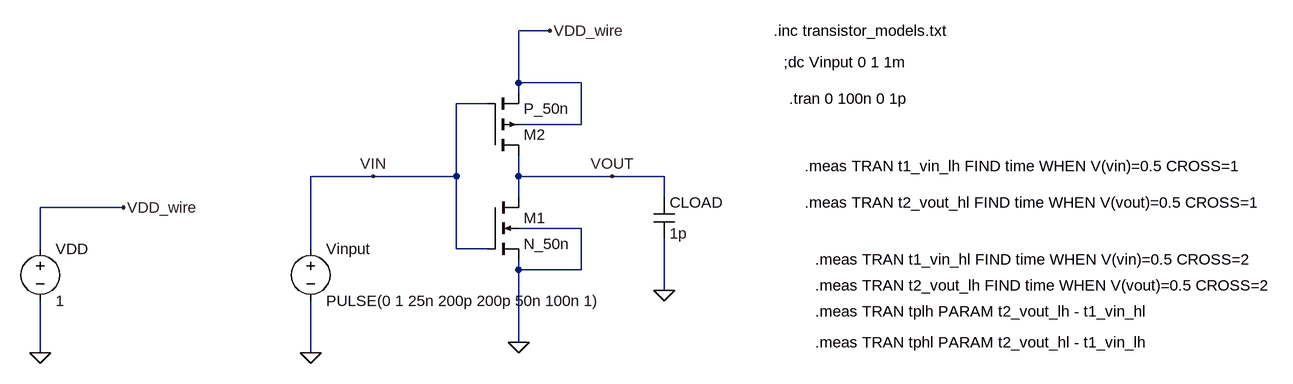
[diagram p0: schematic lab01_inverter_dc.asc]
lab01_inverter_dc.asc, the LTspice schematic file:
Version 4
SHEET 1 1652 680
WIRE 496 -80 448 -80
WIRE 448 0 448 -80
WIRE 544 0 448 0
WIRE 448 16 448 0
WIRE 400 32 352 32
WIRE 544 64 544 0
WIRE 544 64 448 64
WIRE 224 144 128 144
WIRE 352 144 352 32
WIRE 352 144 224 144
WIRE 448 144 448 112
WIRE 592 144 448 144
WIRE 672 144 592 144
WIRE 448 176 448 144
WIRE 672 176 672 144
WIRE -160 192 -288 192
WIRE 544 224 448 224
WIRE -288 256 -288 192
WIRE 128 256 128 144
WIRE 352 256 352 144
WIRE 400 256 352 256
WIRE 448 288 448 272
WIRE 544 288 544 224
WIRE 544 288 448 288
WIRE 672 320 672 240
WIRE 448 400 448 288
WIRE -288 416 -288 336
WIRE 128 416 128 336
FLAG 448 400 0
FLAG 128 416 0
FLAG -288 416 0
FLAG -160 192 VDD_wire
FLAG 496 -80 VDD_wire
FLAG 672 320 0
FLAG 592 144 VOUT
FLAG 224 144 VIN
SYMBOL voltage 128 240 R0
WINDOW 123 0 0 Left 0
WINDOW 39 0 0 Left 0
SYMATTR InstName Vinput
SYMATTR Value PULSE(0 1 25n 200p 200p 50n 100n 1)
SYMBOL voltage -288 240 R0
WINDOW 123 0 0 Left 0
WINDOW 39 0 0 Left 0
SYMATTR InstName VDD
SYMATTR Value 1
SYMBOL nmos4 400 176 R0
SYMATTR InstName M1
SYMATTR Value N_50n
SYMATTR Value2 l=50n w=500n
SYMBOL pmos4 400 112 M180
SYMATTR InstName M2
SYMATTR Value P_50n
SYMATTR Value2 l=50n w=1000n
SYMBOL cap 656 176 R0
SYMATTR InstName CLOAD
SYMATTR Value 1p
TEXT 840 -80 Left 2 !.inc transistor_models.txt
TEXT 856 -32 Left 2 !;dc Vinput 0 1 1m
TEXT 864 24 Left 2 !.tran 0 100n 0 1p
TEXT 888 128 Left 2 !.meas TRAN t1_vin_lh FIND time WHEN V(vin)=0.5 CROSS=1
TEXT 888 184 Left 2 !.meas TRAN t2_vout_hl FIND time WHEN V(vout)=0.5 CROSS=1
TEXT 904 400 Left 2 !.meas TRAN tphl PARAM t2_vout_hl - t1_vin_lh
TEXT 904 272 Left 2 !.meas TRAN t1_vin_hl FIND time WHEN V(vin)=0.5 CROSS=2
TEXT 904 312 Left 2 !.meas TRAN t2_vout_lh FIND time WHEN V(vout)=0.5 CROSS=2
TEXT 904 352 Left 2 !.meas TRAN tplh PARAM t2_vout_lh - t1_vin_hl

The netlist it stands for:
* lab01_inverter_dc.asc
Vinput VIN 0 PULSE(0 1 25n 200p 200p 50n 100n 1)
VDD VDD_wire 0 1
M1 VOUT VIN 0 0 N_50n l=50n w=500n
M2 VOUT VIN VDD_wire VDD_wire P_50n l=50n w=1000n
CLOAD VOUT 0 1p
.model NMOS NMOS
.model PMOS PMOS
.lib standard.mos
.inc transistor_models.txt
;dc Vinput 0 1 1m
.tran 0 100n 0 1p
.meas TRAN t1_vin_lh FIND time WHEN V(vin)=0.5 CROSS=1
.meas TRAN t2_vout_hl FIND time WHEN V(vout)=0.5 CROSS=1
.meas TRAN tphl PARAM t2_vout_hl - t1_vin_lh
.meas TRAN t1_vin_hl FIND time WHEN V(vin)=0.5 CROSS=2
.meas TRAN t2_vout_lh FIND time WHEN V(vout)=0.5 CROSS=2
.meas TRAN tplh PARAM t2_vout_lh - t1_vin_hl
.backanno
.end